# Altium schematic sheet POWER_AMP_BOARD.SchDoc
size 594 x 420 mm; ApprovedBy: Зінгер; Author: Кущинський; Engineer: Сила; DocumentNumber: РЕ21.468732.001 Е3; SheetNumber: 1; SheetTotal: 1; Наименование2: VHF RFPA; Razrabotal: {Разработал}; Proveril: {Проверил}; Utverdil: {Утвердил}; Naimenovanie: {Наименование}; Naymenuvannya: VHF RFPA; Oboznachennia: РЕ21.468732.001 Е3; Rozrobyv: Кущинський; Pereviryv: Сила; Zatverdyv: Зінгер; Pershzastos: {Перш. застос.}; SpravNo: {Справ. №}
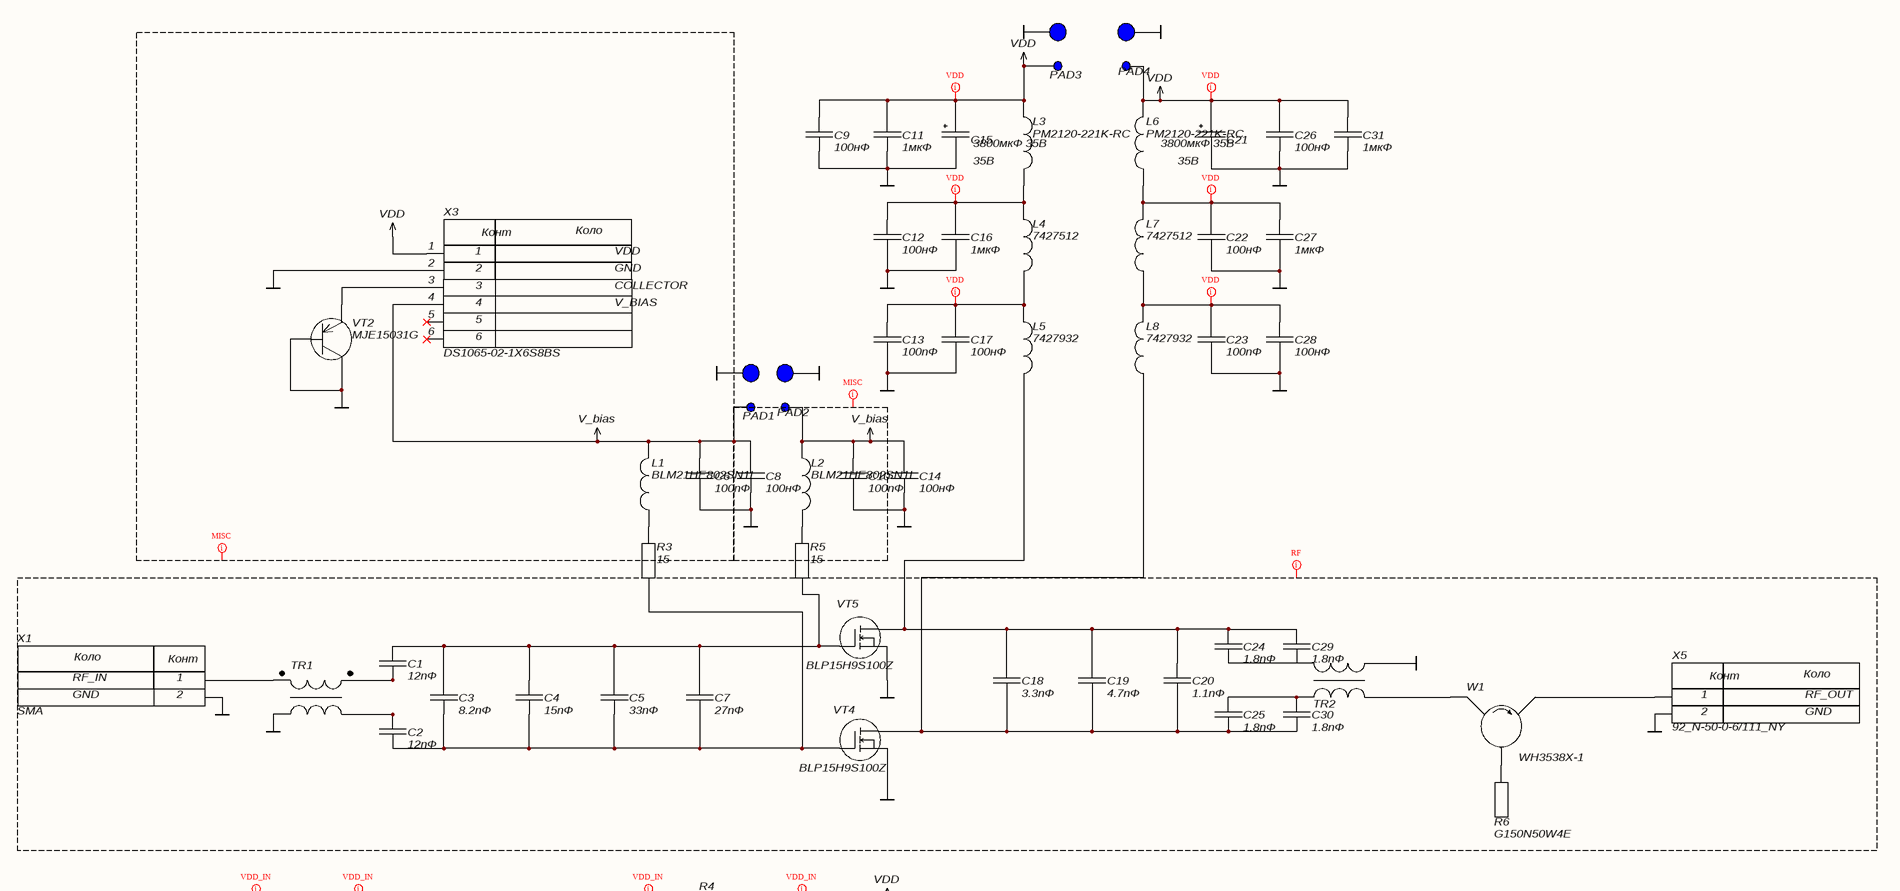
[diagram p0: POWER_AMP_BOARD.SchDoc, top right]
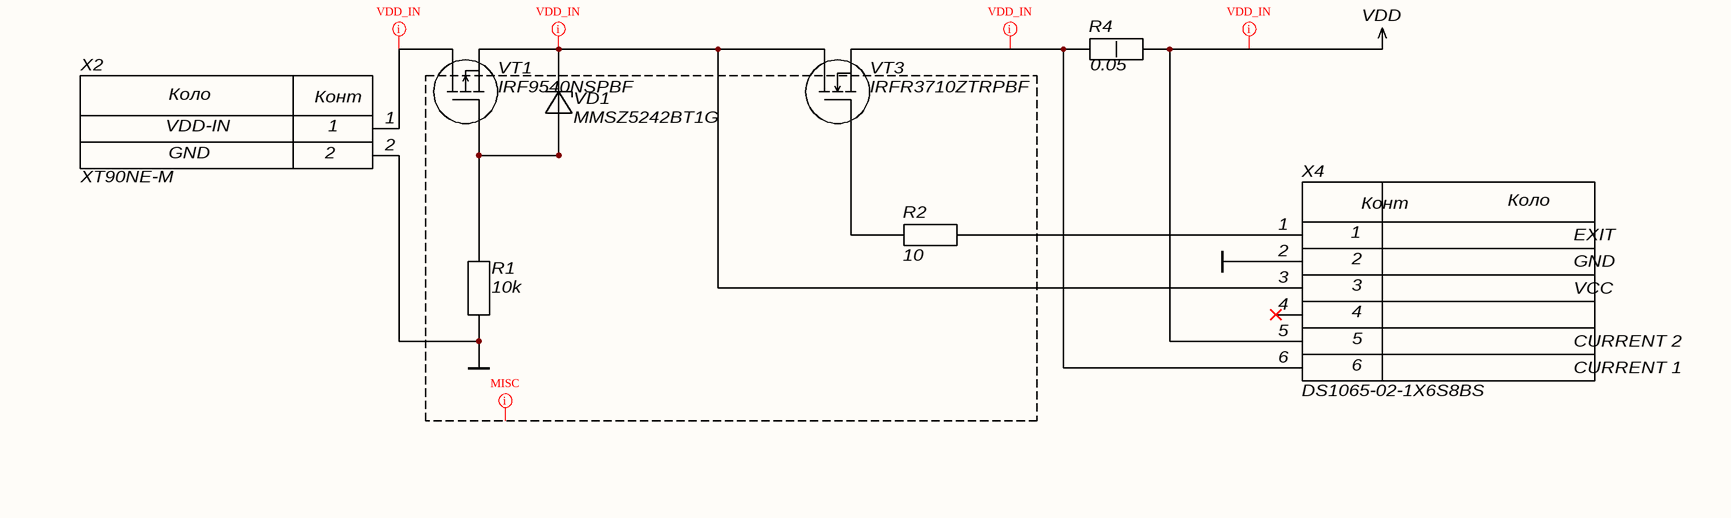
[diagram p1: POWER_AMP_BOARD.SchDoc, bottom right]

## Parts
C1  12пФ  [CAP_600L]
C2  12пФ  [CAP_600L]
C3  8.2пФ  [CAP_600F]
C4  15пФ  [CAP_600F]
C5  33пФ  [CAP_600F]
C6  100пФ  [CAP_0603]
C7  27пФ  [CAP_600F]
C8  100нФ  [CAP_0603]
C9  100нФ  [CAP_0603]
C10  100пФ  [CAP_0603]
C11  1мкФ  [CAP_0603]
C12  100нФ  [CAP_0603]
C13  100пФ  [CAP_0603]
C14  100нФ  [CAP_0603]
C15  3800мкФ 35В  [UCK1V382M]
C16  1мкФ  [CAP_0603]
C17  100нФ  [CAP_0603]
C18  3.3пФ  [CAP_800B]
C19  4.7пФ  [CAP_800B]
C20  1.1пФ  [CAP_800B]
C21  3800мкФ 35В  [UCK1V382M]
C22  100нФ  [CAP_0603]
C23  100пФ  [CAP_0603]
C24  1.8пФ  [CAP_800B]
C25  1.8пФ  [CAP_800B]
C26  100нФ  [CAP_0603]
C27  1мкФ  [CAP_0603]
C28  100нФ  [CAP_0603]
C29  1.8пФ  [CAP_800B]
C30  1.8пФ  [CAP_800B]
C31  1мкФ  [CAP_0603]
L1  BLM21HE802SN1L  [BLM21HE]
L2  BLM21HE802SN1L  [BLM21HE]
L3  PM2120-221K-RC  [PM2120]
L4  7427512  [7427512]
L5  7427932  [7427932]
L6  PM2120-221K-RC  [PM2120]
L7  7427512  [7427512]
L8  7427932  [7427932]
PAD1  Coax_pad_small  [Coax_pad_small]  (value not drawn)
PAD2  Coax_pad_small  [Coax_pad_small]  (value not drawn)
PAD3  Coax_pad_big  [COAX_PAD_BIG]  (value not drawn)
PAD4  Coax_pad_big  [COAX_PAD_BIG]  (value not drawn)
R1  10k  [RC0603N_YAG-L]
R2  10  [RC0603N_YAG-L]
R3  15  [RC0603N_YAG-L]
R4  0.05  [RC2512]
R5  15  [RC0603N_YAG-L]
R6  G150N50W4E  [G150N50W4E]
TR1  ADTL1-12+  [ADTL1-12]  (value not drawn)
TR2  TRAN_OUT  [2661103002]  (value not drawn)
VD1  MMSZ5242BT1G  [MMSZ52]
VT1  IRF9540NSPBF  [IRF9540NSPBF]
VT2  MJE15031G  [MJE15028]
VT3  IRFR3710ZTRPBF  [IRFR3710ZTRPBF]
VT4  BLP15H9S100Z  [BLP15H9S100]
VT5  BLP15H9S100Z  [BLP15H9S100]
W1  WH3538X-1  [WH3538X]
X1  SMA  [0732511143]
X2  XT90NE-M  [XT90NE-M]
X3  DS1065-02-1X6S8BS  [DS1065-02-1X6S8BS]
X4  DS1065-02-1X6S8BS  [DS1065-02-1X6S8BS]
X5  92_N-50-0-6/111_NY  [92_N-50-0-6/111_NY]

## Nets
GND: C6.1 C8.1 C9.1 C10.1 C11.1 C12.1 C13.1 C14.1 C15.1 C16.1 C17.1 C21.1 C22.1 C23.1 C26.1 C27.1 C28.1 C31.1 PAD1.2 PAD2.2 PAD3.2 PAD4.2 R1.1 TR1.3 TR2.2(OUT) VT2.1(b) VT2.2(k) VT4.3(S) VT5.3(S) X1.2 X2.2 X3.2 X4.2 X5.2
V_bias: C6.2 C8.2 C10.2 C14.2 L1.2 L2.2 PAD1.1 PAD2.1 X3.4
VDD: C9.2 C11.2 C15.2 C21.2 C26.2 C31.2 L3.1 L6.1 PAD3.1 PAD4.1 R4.2 X3.1 X4.5
NetC1_1: C1.1 TR1.6
NetC1_2: C1.2 C3.2 C4.2 C5.2 C7.2 R5.1 VT5.2(G)
NetC2_1: C2.1 C3.1 C4.1 C5.1 C7.1 R3.1 VT4.2(G)
NetC2_2: C2.2 TR1.4
NetC12_2: C12.2 C16.2 L3.2 L4.2
NetC13_2: C13.2 C17.2 L4.1 L5.1
NetC18_1: C18.1 C19.1 C20.1 C25.1 C30.1 L8.2 VT4.1(D)
NetC18_2: C18.2 C19.2 C20.2 C24.2 C29.2 L5.2 VT5.1(D)
NetC22_2: C22.2 C27.2 L6.2 L7.2
NetC23_2: C23.2 C28.2 L7.1 L8.1
NetC24_1: C24.1 C29.1 TR2.1(IN_1)
NetC25_2: C25.2 C30.2 TR2.3(IN_2)
NetL1_1: L1.1 R3.2
NetL2_1: L2.1 R5.2
NetR1_2: R1.2 VD1.2 VT1.1(G)
NetR2_1: R2.1 VT3.1(G)
NetR2_2: R2.2 X4.1
NetR4_1: R4.1 VT3.3(S) X4.6
NetR6_1: R6.1 W1.3
NetTR1_1: TR1.1 X1.1
NetTR2_4: TR2.4(GND) W1.1
NetVD1_1: VD1.1 VT1.2(S) VT3.2(D) X4.3
NetVT1_3: VT1.3(D) X2.1
NetVT2_3: VT2.3(e) X3.3
NetW1_2: W1.2 X5.1

Not connected (* = marked no-connect by the designer): X3 5(2)* 6(2)*; X4 4(2)*

## Layout directives
net class VDD: NetC12_2, NetC13_2, NetC22_2, NetC23_2, VDD
net class VDD_IN: NetR4_1, NetVD1_1, NetVT1_3, VDD
net class MISC: GND, V_bias, VDD
net class RF: GND

## Notes on the sheet
- 35В
- (near L6) 35В
- Перш. застос.
- Справ. №
- Зм.
- Лист
- № докум.
- Підпис
- Дата
- Літ.
- Маса
- Масштаб
- Розроб.
- Перев.
- Т. контр.
- Листів
- Н. контр.
- Затв.
- Копіював:
- Формат А2
- (in symbol DS1065-02-1X6S8BS) Конт; Коло; EXIT; GND; VCC; CURRENT 2; CURRENT 1
- (in symbol DS1065-02-1X6S8BS_1) Конт; Коло; VDD; GND; COLLECTOR; V_BIAS
- (in symbol N-Type) Конт; Коло; RF_OUT; GND
- (in symbol SMA) Коло; Конт; RF_IN; GND
- (in symbol XT90NE-M) Коло; Конт; VDD-IN; GND

## Library data of the parts
C1 C2 = CAP_600L: ComponentLink1Description: Datasheet; ComponentLink1URL: https://www.srt-microceramique.com/phototheque/photos/pdf/Footprint.pdf
C3-C5 C7 = CAP_600F: ComponentLink1Description: Datasheet; ComponentLink1URL: https://www.srt-microceramique.com/phototheque/photos/pdf/Footprint.pdf
C6 C8-C14 C16 C17 C22 C23 C26-C28 C31 = CAPASITOR_0603
C15 C21 = SMD_CAP_POL_3800uF_35V: UCK1V382MNJ1MS,3800 µF 35 V Aluminum Electrolytic Capacitors Radial, Can - SMD 5000 Hrs @ 105°C, Nichicon; ComponentLink1Description: Datasheet; ComponentLink1URL: https://www.nichicon.co.jp/english/series_items/catalog_pdf/e-uck.pdf
C18-C20 C24 C25 C29 C30 = CAP_800B: ComponentLink1Description: Datasheet; ComponentLink1URL: https://www.srt-microceramique.com/phototheque/photos/pdf/Footprint.pdf
L1 L2 = BLM21HE802SN1L: BLM21HE802SN1L, GHz Noise Suppression Chip Ferrite Bead FERRITE BEAD 8 KOHM 0805 1LN, Murata; ComponentLink1Description: Datasheet; ComponentLink1URL: https://www.mouser.com/catalog/specsheets/Murata_12-12-2022_601122472802.pdf; ComponentLink2Description: New link; ComponentLink2URL: https://pim.murata.com/en-us/pim/details/?partNum=BLM21HE802SN1L&displayChangeClass=productDetailPrint
L3 L6 = PM2120-221K-RC: PM2120-221K-RC, FIXED IND 220UH 5A 52 MOHM SMD, Bourns; ComponentLink1Description: Datasheet; ComponentLink1URL: https://www.bourns.com/docs/Product-Datasheets/pm2120_series.pdf
L4 L7 = 7427512: 7427512, WE-SUKW SMT EMI Suppression 5-Hole Ferrite Bead 580 OHM 2020 1LN, Wurth; ComponentLink1Description: Datasheet; ComponentLink1URL: https://www.digikey.com/en/products/detail/w%C3%BCrth-elektronik/7427512/2178259
L5 L8 = 7427932: 7427932, WE-PBF Flat Wire High Current SMT Ferrite Bead 98 OHM 2SMD 1LN, Wurth; ComponentLink1Description: Datasheet; ComponentLink1URL: https://www.we-online.com/components/products/datasheet/7427932.pdf
R1-R3 R5 = RES_0603: ComponentLink1Description: Datasheet; ComponentLink1URL: https://www.digikey.com/Site/Global/Layouts/DownloadPdf.ashx?pdfUrl=79FA4E6269084805AAD01E8F0265FFC8
R4 = RES_2512: PN: WW25RR005FTL
R6 = G150N50W4E: G150N50W4E, Flange Mount Termination / 150 Watts 50Ω, TTM; ComponentLink1Description: Datasheet; ComponentLink1URL: https://cdn.ttm.com/repository/products/wireless-resistive/terminations-flanged/G150N50W4E/G150N50W4E.pdf
TR1 = ADTL1-12+: ADTL1-12+,1:1 CORE & WIRE Transformer, 20 - 1200 MHz, 50Ω. Mini-Circuits; ComponentLink1Description: Support; ComponentLink1URL: https://www.minicircuits.com/WebStore/dashboard.html?model=ADTL1-12%2B; ComponentLink2Description: Datasheet; ComponentLink2URL: https://www.minicircuits.com/pdfs/ADTL1-12.pdf
VD1 = MMSZ52: ComponentLink1Description: Datasheet; ComponentLink1URL: https://www.onsemi.com/download/data-sheet/pdf/mmsz5221bt1-d.pdf
VT1 = IRF9540NSPBF: IRF9540NSPBF, MOSFET P CHANAL 100V 23A D2PAK, IR; ComponentLink1Description: Datasheet; ComponentLink1URL: https://www.infineon.com/assets/row/public/documents/24/49/irf9540nspbf.pdf?fileId=5546d462533600a401535611d92a1dca
VT2 = MJE15031: MJE15031G, TO220, ON; ComponentLink1Description: Datasheet; ComponentLink1URL: https://www.onsemi.com/download/data-sheet/pdf/mje15028-d.pdf
VT3 = IRFR3710ZTRPBF: IRFR3710ZTRPBF, MOSFET N CHANAL 100V 56A D2PAK, Infifion; ComponentLink1Description: Datasheet; ComponentLink1URL: https://www.infineon.com/assets/row/public/documents/24/49/infineon-irfr3710z-datasheet-en.pdf?fileId=5546d462533600a401535631b29d20cb
VT4 VT5 = BLP15H9S100Z: BLP15H9S100, Power LDMOS transistor, Ampleon; ComponentLink1Description: Datasheet; ComponentLink1URL: https://www.ampleon.com/documents/data-sheet/BLP15H9S100.pdf
W1 = WH3538X-1: WH3538X-1, Clockwise 400-430MHz Embedded Microstrip RF Circulator, RFTYT; ComponentLink1Description: Datasheet; ComponentLink1URL: https://www.rf-tyt.com/uploads/32109/files/7-WH3538X-300-1800MHz.pdf
X2 = XT90NE-M: XT90NE-M, Amass; ComponentLink1Description: New link; ComponentLink1URL: https://www.tme.eu/Document/255ea20ff2e08b64ed0cb3a1a65f0a51/XT90E-M.pdf
X3 = DS1065-02-1X6S8BS_1: System: Connector; ComponentLink1Description: DATASHEET; ComponentLink1URL: https://www.tme.eu/Document/15d9b437c408a6705cfd6c6fa6a41aa0/DS1065-02.pdf
X5 = N-Type: ComponentLink2Description: Support; ComponentLink3Description: Datasheet
X1 = SMA: ComponentLink1Description: New link; ComponentLink1URL: https://www.amphenolrf.com/132142.html
X4 = DS1065-02-1X6S8BS: ComponentLink1Description: DATASHEET; ComponentLink1URL: https://www.tme.eu/Document/15d9b437c408a6705cfd6c6fa6a41aa0/DS1065-02.pdf